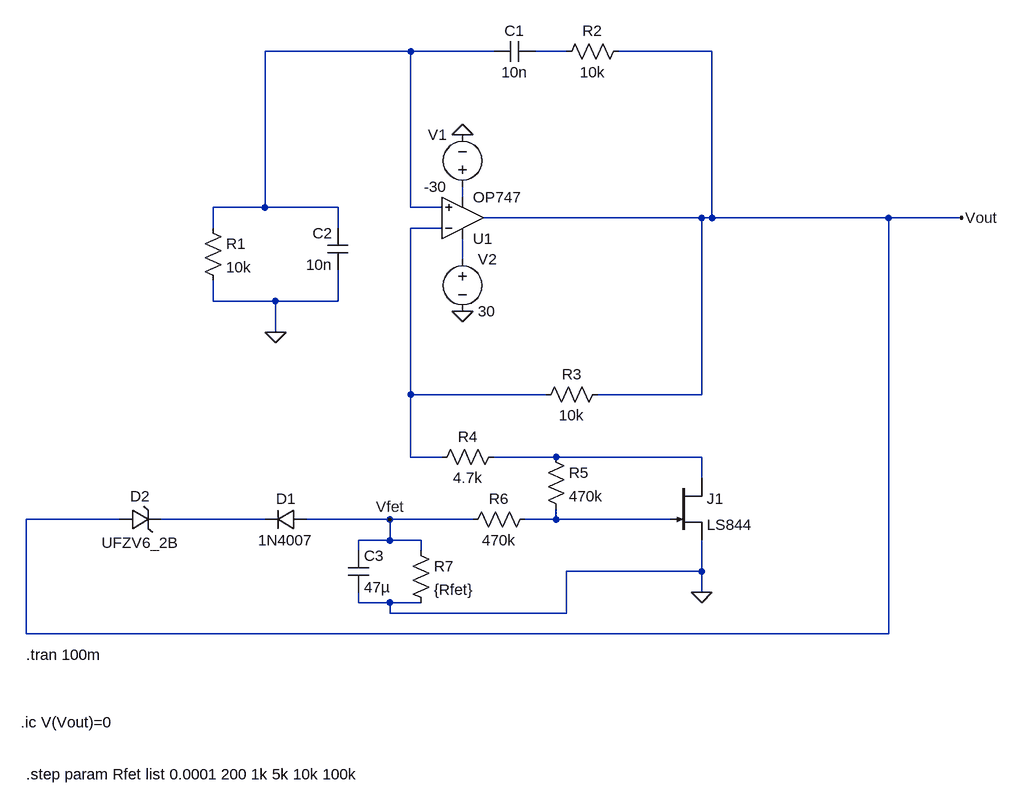
[diagram p0: schematic puente de wein.asc]
puente de wein.asc, the LTspice schematic file:
Version 4
SHEET 1 1076 1068
WIRE 144 -64 -80 -64
WIRE 272 -64 144 -64
WIRE 384 -64 336 -64
WIRE 608 -64 464 -64
WIRE 224 160 224 144
WIRE -80 176 -80 -64
WIRE -80 176 -160 176
WIRE 32 176 -80 176
WIRE 144 176 144 -64
WIRE 192 176 144 176
WIRE 592 192 256 192
WIRE 608 192 608 -64
WIRE 608 192 592 192
WIRE 880 192 608 192
WIRE 992 192 880 192
WIRE -160 208 -160 176
WIRE 32 208 32 176
WIRE 192 208 144 208
WIRE 224 256 224 224
WIRE -160 320 -160 288
WIRE -64 320 -160 320
WIRE 32 320 32 272
WIRE 32 320 -64 320
WIRE -64 368 -64 320
WIRE 144 464 144 208
WIRE 352 464 144 464
WIRE 592 464 592 192
WIRE 592 464 432 464
WIRE 144 560 144 464
WIRE 192 560 144 560
WIRE 368 560 272 560
WIRE 592 560 368 560
WIRE 592 592 592 560
WIRE -304 656 -448 656
WIRE -80 656 -240 656
WIRE 112 656 -16 656
WIRE 240 656 112 656
WIRE 368 656 368 640
WIRE 368 656 320 656
WIRE 544 656 368 656
WIRE 112 688 112 656
WIRE 112 688 64 688
WIRE 160 688 112 688
WIRE 64 704 64 688
WIRE 160 704 160 688
WIRE 592 736 592 688
WIRE 592 736 384 736
WIRE 592 768 592 736
WIRE 64 784 64 768
WIRE 112 784 64 784
WIRE 160 784 112 784
WIRE 112 800 112 784
WIRE 384 800 384 736
WIRE 384 800 112 800
WIRE -448 832 -448 656
WIRE 880 832 880 192
WIRE 880 832 -448 832
FLAG 224 64 0
FLAG 224 336 0
FLAG 992 192 Vout
FLAG 592 768 0
FLAG -64 368 0
FLAG 112 656 Vfet
SYMBOL cap 336 -80 R90
WINDOW 0 0 32 VBottom 2
WINDOW 3 32 32 VTop 2
SYMATTR InstName C1
SYMATTR Value 10n
SYMBOL cap 48 272 R180
WINDOW 0 24 56 Left 2
WINDOW 3 24 8 Left 2
SYMATTR InstName C2
SYMATTR Value 10n
SYMBOL res -176 192 R0
SYMATTR InstName R1
SYMATTR Value 10k
SYMBOL res 480 -80 R90
WINDOW 0 0 56 VBottom 2
WINDOW 3 32 56 VTop 2
SYMATTR InstName R2
SYMATTR Value 10k
SYMBOL voltage 224 160 R180
WINDOW 0 24 96 Left 2
WINDOW 3 24 16 Left 2
WINDOW 123 0 0 Left 0
WINDOW 39 0 0 Left 0
SYMATTR InstName V1
SYMATTR Value -30
SYMBOL voltage 224 240 R0
SYMATTR InstName V2
SYMATTR Value 30
SYMBOL res 448 448 R90
WINDOW 0 0 56 VBottom 2
WINDOW 3 32 56 VTop 2
SYMATTR InstName R3
SYMATTR Value 10k
SYMBOL res 176 576 R270
WINDOW 0 32 56 VTop 2
WINDOW 3 0 56 VBottom 2
SYMATTR InstName R4
SYMATTR Value 4.7k
SYMBOL res 352 544 R0
SYMATTR InstName R5
SYMATTR Value 470k
SYMBOL njf 544 592 R0
SYMATTR InstName J1
SYMATTR Value LS844
SYMBOL diode -16 640 R90
WINDOW 0 0 32 VBottom 2
WINDOW 3 32 32 VTop 2
SYMATTR InstName D1
SYMATTR Value 1N4007
SYMBOL sym\\zener -304 672 R270
WINDOW 0 36 32 VTop 2
WINDOW 3 -4 32 VBottom 2
SYMATTR InstName D2
SYMATTR Value UFZV6_2B
SYMBOL res 336 640 R90
WINDOW 0 0 56 VBottom 2
WINDOW 3 32 56 VTop 2
SYMATTR InstName R6
SYMATTR Value 470k
SYMBOL OpAmps\\OP747 224 256 M180
SYMATTR InstName U1
SYMBOL cap 48 704 R0
SYMATTR InstName C3
SYMATTR Value 47µ
SYMBOL res 144 688 R0
SYMATTR InstName R7
SYMATTR Value {Rfet}
TEXT -448 864 Left 2 !.tran 100m
TEXT -456 968 Left 2 !.ic V(Vout)=0
TEXT -448 1048 Left 2 !.step param Rfet list 0.0001 200 1k 5k 10k 100k

The netlist it stands for:
* puente de wein.asc
C1 N002 N001 10n
C2 0 N001 10n
R1 N001 0 10k
R2 Vout N002 10k
V1 N003 0 -30
V2 N005 0 30
R3 Vout N004 10k
R4 N004 N006 4.7k
R5 N006 N008 470k
J1 N006 N008 0 LS844
D1 Vfet N007 1N4007
D2 Vout N007 UFZV6_2B
R6 N008 Vfet 470k
XU1 N001 N004 N005 N003 Vout OP747  ; pins In+ In- V+ V- OUT
C3 Vfet 0 47µ
R7 Vfet 0 {Rfet}
.model D D
.lib standard.dio
.model NJF NJF
.model PJF PJF
.lib standard.jft
.tran 100m
.ic V(Vout)=0
.step param Rfet list 0.0001 200 1k 5k 10k 100k
.backanno
.end